# Altium schematic sheet Low Distortion Oscillator.Con.SchDoc
size A4; SheetNumber: 1; SheetTotal: 1
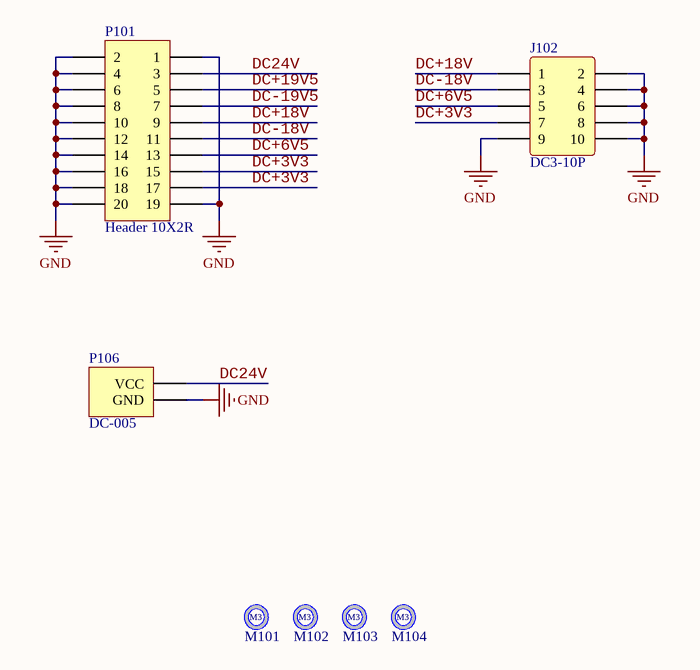
[diagram p0: Low Distortion Oscillator.Con.SchDoc]

## Parts
J102  DC3-10P  [DC3-10P]
M101  M3  [M3-3.2X5]  (value not drawn)
M102  M3  [M3-3.2X5]  (value not drawn)
M103  M3  [M3-3.2X5]  (value not drawn)
M104  M3  [M3-3.2X5]  (value not drawn)
P101  Header 10X2R  [HDR2X10LFR]
P106  DC-005  [DC-005]

## Nets
GND: J102.2 J102.4 J102.6 J102.8 J102.9 J102.10 P101.1 P101.2 P101.4 P101.6 P101.8 P101.10 P101.12 P101.14 P101.16 P101.18 P101.19 P101.20 P106.2(GND)
DC24V: P101.3 P106.1(VCC)
DC+3V3: J102.7 P101.15 P101.17
DC+6V5: J102.5 P101.13
DC+18V: J102.1 P101.9
DC+19V5: P101.5
DC-18V: J102.3 P101.11
DC-19V5: P101.7

## Library data of the parts
P101 = Header 10X2R: Header, 10-Pin, Dual row, Pin 1 on Right